# Altium schematic sheet Screen Driver.SchDoc: Graphics Driver PCB (part 3 of 3)
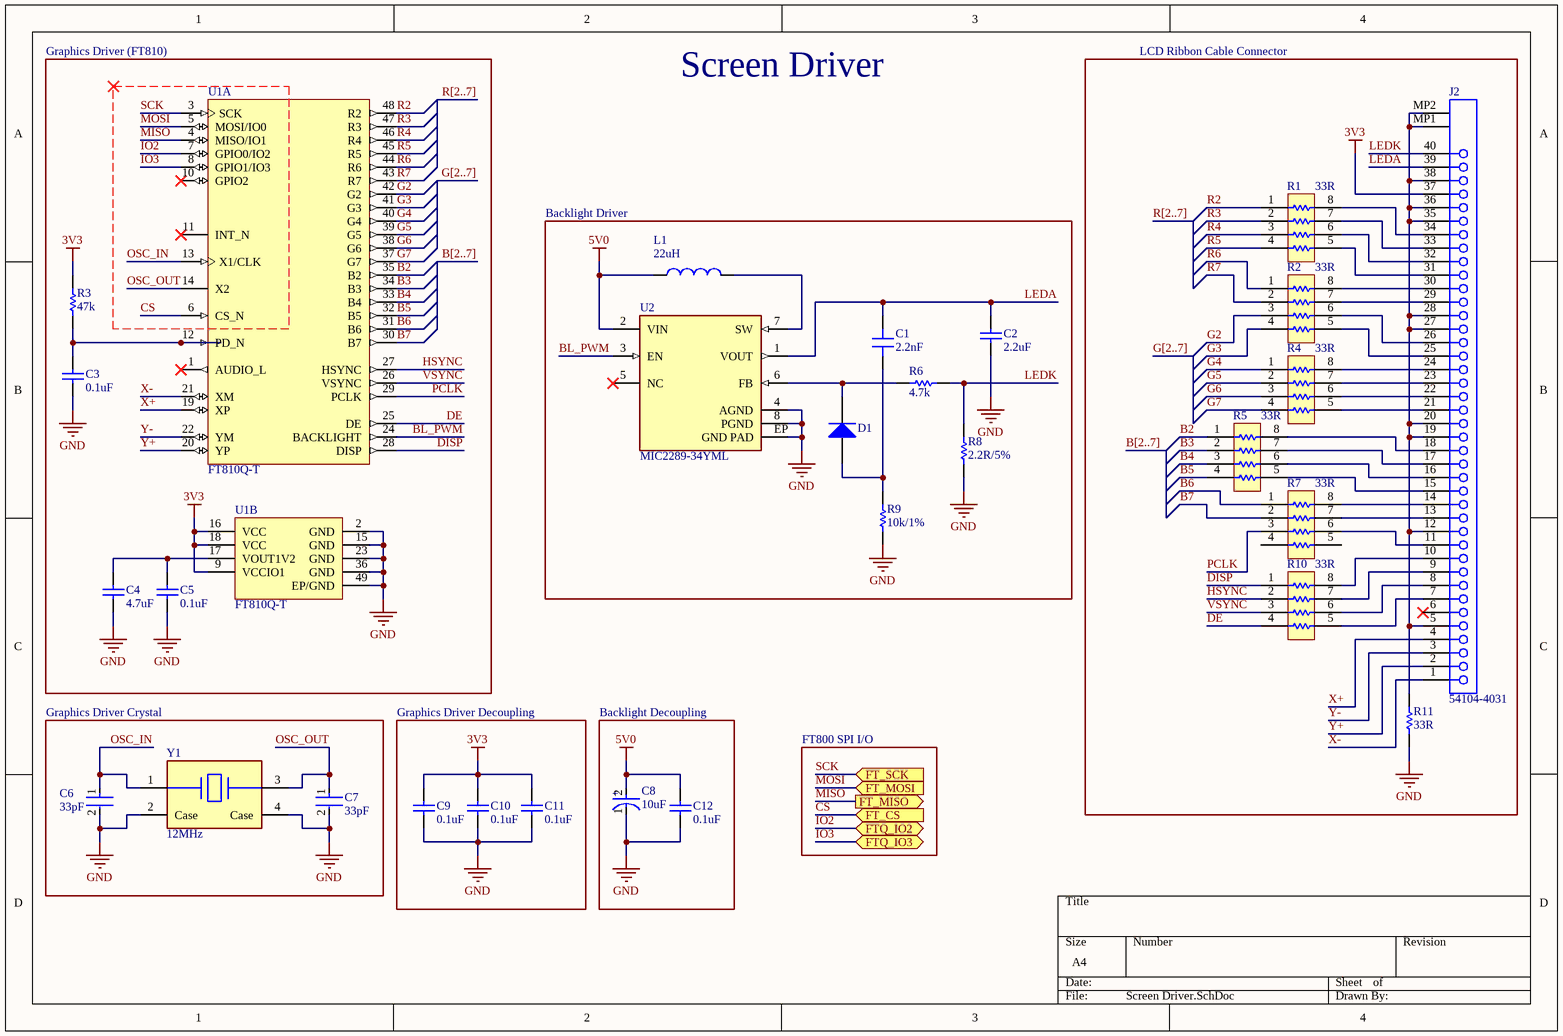
[diagram p2: Screen Driver.SchDoc]

## Library data of the parts (continued)
R8 = Resistor: Resistor;  Thick Film;  Res 2.2 Ohms;  Pwr-Rtg 0.125 W;  Tol 5%;  SMT;  0805;  Tape & Reel; Manufacturer: Panasonic; Manufacturer Part Number: ERJ-6GEYJ2R2V; Resistance: 2.2R; Power Rating: 125mW; Temperature Coefficient: 600ppm/°C; Voltage Rating (DC): 150V; Value: 2.2R/5%; Supplier 1: LCSC; Supplier Part Number 1: C413132; RoHS: Yes; Category: Chip SMD Resistors; Stock 1: 19900; Pricing 1: 50=0.00990, 500=0.00720, 1500=0.00670, 5000=0.00630, 25000=0.00600, 50000=0.00590, 50=0.00940, 500=0.00690, 1500=0.00640, 5000=0.00600, 25000=0.00580, 50000=0.00570, 50=0.04810, 500=0.03510, 1500=0.03280, 5000=0.03040, 25000=0.02930, 50000=0.02880, 50=0.04470, 500=0.03270, 1500=0.03050, 5000=0.02830, 25000=0.02730, 50000=0.02680, 50=0.00600, 500=0.00440, 1500=0.00410, 5000=0.00380, 25000=0.00370, 50000=0.00360, 50=0.00550, 500=0.00400, 1500=0.00370, 5000=0.00350, 25000=0.00330, 50000=0.00330, 50=0.05470, 500=0.04000, 1500=0.03730, 5000=0.03460, 25000=0.03340, 50000=0.03280, 50=0.74590, 500=0.54510, 1500=0.50830, 5000=0.47140, 25000=0.45500, 50000=0.44690, 50=0.02930, 500=0.02140, 1500=0.02000, 5000=0.01850, 25000=0.01790, 50000=0.01760, 50=0.55670, 500=0.40690, 1500=0.37930, 5000=0.35180, 25000=0.33960, 50000=0.33350, 50=0.06320, 500=0.04620, 1500=0.04310, 5000=0.04000, 25000=0.03860, 50000=0.03790, 50=0.00970, 500=0.00710, 1500=0.00660, 5000=0.00610, 25000=0.00590, 50000=0.00580, 50=0.00706, 500=0.00516, 1500=0.00481, 5000=0.00446, 25000=0.00431, 50000=0.00423 (AUD); Mount: Surface Mount; Case/Package: 0805; Case Code (Imperial): 0805; Case Code (Metric): 2012; Contact Plating: Tin; Min Operating Temperature: -55°C; Max Operating Temperature: 155°C; Tolerance: 5%; Packaging: Tape and Reel; Resistor Type: Thick Film; Termination: SMD/SMT; Package Quantity: 1; Voltage Rating: 150V; Number of Terminations: 2; Max Power Dissipation: 125mW; Features: Automotive AEC-Q200; Length: 2mm; Height: 0.6mm; Width: 1.25mm; Depth: 1.25mm; Radiation Hardening: No; Lead Free: Lead Free; Military Standard: Not; REACH SVHC: No SVHC; ComponentLink1URL: https://datasheet.ciiva.com/11821/0900766b80f806dd-11821604.pdf?src-supplier=RSComponents; ComponentLink1Description: https://datasheet.ciiva.com/11821/0900766b80f806dd-11821604.pdf?src-supplier=RSComponents; ComponentLink2URL: https://datasheet.ciiva.com/28680/1678796-28680822.pdf?src-supplier=Element14; ComponentLink2Description: https://datasheet.ciiva.com/28680/1678796-28680822.pdf?src-supplier=Element14; ComponentLink3URL: https://datasheet.ciiva.com/46373/1500035-46373994.pdf?src-supplier=Element14; ComponentLink3Description: https://datasheet.ciiva.com/46373/1500035-46373994.pdf?src-supplier=Element14; ComponentLink4URL: https://datasheet.ciiva.com/16771/70255313-16771325.pdf?src-supplier=Allied+Electronics; ComponentLink4Description: https://datasheet.ciiva.com/16771/70255313-16771325.pdf?src-supplier=Allied+Electronics; ComponentLink5URL: https://datasheet.ciiva.com/30154/4aoa0000ce1-30154238.pdf?src-supplier=Onlinecomponents.com; ComponentLink5Description: https://datasheet.ciiva.com/30154/4aoa0000ce1-30154238.pdf?src-supplier=Onlinecomponents.com; ComponentLink6URL: https://datasheet.ciiva.com/46386/1500035-46386709.pdf?src-supplier=Element14; ComponentLink6Description: https://datasheet.ciiva.com/46386/1500035-46386709.pdf?src-supplier=Element14; ComponentLink7URL: https://datasheet.ciiva.com/5868/1500035-5868203.pdf?src-supplier=Farnell; ComponentLink7Description: https://datasheet.ciiva.com/5868/1500035-5868203.pdf?src-supplier=Farnell; Supplier 2: Digi-Key; Supplier Part Number 2: P2.2ACT-ND; Stock 2: 66099; Pricing 2: 1=0.10000, 10=0.04900, 100=0.02010, 1000=0.00901, 2500=0.00782 (USD)
R9 = Resistor: PANASONIC - ERJ6ENF1002V - Ytmonterat chipmotstånd, Tjockfilm, 0805 [2012 Metrisk], 10 kohm, ERJ6E Serien, 150 V, Tjockfilm; Manufacturer Part Number: ERJ-6ENF1002V; Resistance: 10kR; Tolerance: 1%; Temperature Coefficient: 100ppm/°C; Power Rating: 125mW; Voltage Rating: 150V; Value: 10k/1%; Supplier 1: LCSC; Supplier Part Number 1: C169253; Manufacturer: Panasonic; RoHS: Yes; Category: Chip SMD Resistors; Stock 1: 51350; Pricing 1: 50=0.01510, 500=0.01110, 1500=0.01040, 5000=0.00970, 25000=0.00930, 50000=0.00920, 50=0.01440, 500=0.01060, 1500=0.00990, 5000=0.00920, 25000=0.00890, 50000=0.00880, 50=0.07360, 500=0.05410, 1500=0.05050, 5000=0.04700, 25000=0.04540, 50000=0.04460, 50=0.06850, 500=0.05030, 1500=0.04700, 5000=0.04370, 25000=0.04220, 50000=0.04150, 50=0.00920, 500=0.00680, 1500=0.00630, 5000=0.00590, 25000=0.00570, 50000=0.00560, 50=0.00840, 500=0.00620, 1500=0.00580, 5000=0.00540, 25000=0.00520, 50000=0.00510, 50=0.08370, 500=0.06150, 1500=0.05750, 5000=0.05340, 25000=0.05160, 50000=0.05070, 50=1.14090, 500=0.83920, 1500=0.78370, 5000=0.72830, 25000=0.70360, 50000=0.69140, 50=0.04490, 500=0.03300, 1500=0.03080, 5000=0.02860, 25000=0.02770, 50000=0.02720, 50=0.85150, 500=0.62630, 1500=0.58490, 5000=0.54360, 25000=0.52510, 50000=0.51600, 50=0.09670, 500=0.07120, 1500=0.06650, 5000=0.06180, 25000=0.05970, 50000=0.05860, 50=0.01480, 500=0.01090, 1500=0.01010, 5000=0.00940, 25000=0.00910, 50000=0.00890, 50=0.01080, 500=0.00794, 1500=0.00742, 5000=0.00689, 25000=0.00666, 50000=0.00654 (AUD); Mount: Surface Mount; Case/Package: 0805; Number of Pins: 2; Case Code (Metric): 2012; Case Code (Imperial): 0805; Contact Plating: Tin; Min Operating Temperature: -55°C; Max Operating Temperature: 155°C; Packaging: Tape and Reel; Resistor Type: Thick Film; Termination: SMD/SMT; Package Quantity: 5000; Voltage Rating (DC): 150V; Number of Terminations: 2; Max Power Dissipation: 125mW; Features: Automotive AEC-Q200; Working Voltage: 150V; Length: 2mm; Height: 0.6mm; Width: 0.049inch; Depth: 1.25mm; Radiation Hardening: No; Lead Free: Lead Free; Military Standard: Not; REACH SVHC: No SVHC; ComponentLink1URL: https://datasheet.ciiva.com/11808/0900766b80f80784-11808080.pdf?src-supplier=RSComponents; ComponentLink1Description: https://datasheet.ciiva.com/11808/0900766b80f80784-11808080.pdf?src-supplier=RSComponents; ComponentLink2URL: https://datasheet.ciiva.com/16759/70260748-16759350.pdf?src-supplier=Allied+Electronics; ComponentLink2Description: https://datasheet.ciiva.com/16759/70260748-16759350.pdf?src-supplier=Allied+Electronics; ComponentLink3URL: https://datasheet.ciiva.com/16725/70260748-16725031.pdf?src-supplier=Allied+Electronics; ComponentLink3Description: https://datasheet.ciiva.com/16725/70260748-16725031.pdf?src-supplier=Allied+Electronics; ComponentLink4URL: https://datasheet.ciiva.com/30140/aoa0000ce2-30140236.pdf?src-supplier=Onlinecomponents.com; ComponentLink4Description: https://datasheet.ciiva.com/30140/aoa0000ce2-30140236.pdf?src-supplier=Onlinecomponents.com; ComponentLink5URL: https://datasheet.ciiva.com/24070/aoa0000ce2-24070702.pdf?src-supplier=Mouser; ComponentLink5Description: https://datasheet.ciiva.com/24070/aoa0000ce2-24070702.pdf?src-supplier=Mouser; ComponentLink6URL: https://datasheet.ciiva.com/16514/aoa0000ce2-16514021.pdf?src-supplier=Avnet+Asia; ComponentLink6Description: https://datasheet.ciiva.com/16514/aoa0000ce2-16514021.pdf?src-supplier=Avnet+Asia; ComponentLink7URL: https://datasheet.ciiva.com/27055/1988971-27055733.pdf?src-supplier=Jameco; ComponentLink7Description: https://datasheet.ciiva.com/27055/1988971-27055733.pdf?src-supplier=Jameco; ComponentLink8URL: https://datasheet.ciiva.com/7830/426256-7830745.pdf?src-supplier=Element14; ComponentLink8Description: https://datasheet.ciiva.com/7830/426256-7830745.pdf?src-supplier=Element14; ComponentLink9URL: https://datasheet.ciiva.com/46372/1678782-46372714.pdf?src-supplier=Element14; ComponentLink9Description: https://datasheet.ciiva.com/46372/1678782-46372714.pdf?src-supplier=Element14; ComponentLink10URL: https://datasheet.ciiva.com/46372/1678782-46372715.pdf?src-supplier=Element14; ComponentLink10Description: https://datasheet.ciiva.com/46372/1678782-46372715.pdf?src-supplier=Element14; ComponentLink11URL: https://datasheet.ciiva.com/17212/aoa0000ce2-17212108.pdf?src-supplier=Avnet+Europe; ComponentLink11Description: https://datasheet.ciiva.com/17212/aoa0000ce2-17212108.pdf?src-supplier=Avnet+Europe; Supplier 2: Digi-Key; Supplier Part Number 2: P10.0KCCT-ND; Stock 2: 673575; Pricing 2: 1=0.10000, 10=0.06500, 100=0.02500, 1000=0.01100, 2500=0.00950 (USD)
R11 = Resistor: Res Thick Film 0805 33 Ohm 1% 0.125W(1/8W) ±100ppm/C Molded SMD Automotive Punched T/R; Manufacturer: Panasonic; Manufacturer Part Number: ERJ-6ENF33R0V; Temperature Coefficient: 100ppm/°C; Power Rating: 125mW; Voltage Rating (DC): 150V; Value: 33R; Supplier 1: LCSC; Supplier Part Number 1: C413254; RoHS: Yes; Category: Chip SMD Resistors; Stock 1: 20950; Pricing 1: 50=0.01480, 500=0.01080, 1500=0.01010, 5000=0.00940, 25000=0.00900, 50000=0.00890, 50=0.01420, 500=0.01040, 1500=0.00970, 5000=0.00900, 25000=0.00860, 50000=0.00850, 50=0.07210, 500=0.05270, 1500=0.04910, 5000=0.04560, 25000=0.04400, 50000=0.04320, 50=0.06710, 500=0.04900, 1500=0.04570, 5000=0.04240, 25000=0.04090, 50000=0.04020, 50=0.00900, 500=0.00660, 1500=0.00610, 5000=0.00570, 25000=0.00550, 50000=0.00540, 50=0.00820, 500=0.00600, 1500=0.00560, 5000=0.00520, 25000=0.00500, 50000=0.00490, 50=0.08200, 500=0.05990, 1500=0.05590, 5000=0.05180, 25000=0.05000, 50000=0.04910, 50=1.11830, 500=0.81730, 1500=0.76200, 5000=0.70680, 25000=0.68220, 50000=0.67010, 50=0.04400, 500=0.03210, 1500=0.03000, 5000=0.02780, 25000=0.02680, 50000=0.02640, 50=0.83460, 500=0.61000, 1500=0.56870, 5000=0.52750, 25000=0.50920, 50000=0.50010, 50=0.09480, 500=0.06930, 1500=0.06460, 5000=0.05990, 25000=0.05790, 50000=0.05680, 50=0.01450, 500=0.01060, 1500=0.00990, 5000=0.00910, 25000=0.00880, 50000=0.00870, 50=0.01058, 500=0.00773, 1500=0.00721, 5000=0.00669, 25000=0.00646, 50000=0.00634 (AUD); Mount: Surface Mount; Case/Package: 0805; Number of Pins: 2; Case Code (Imperial): 0805; Case Code (Metric): 2012; Contact Plating: Tin; Min Operating Temperature: -55°C; Max Operating Temperature: 155°C; Resistance: 33R; Tolerance: 1%; Packaging: Tape and Reel; Resistor Type: Thick Film; Package Quantity: 5000; Voltage Rating: 150V; Number of Terminations: 2; Termination: SMD/SMT; Max Power Dissipation: 125mW; Length: 2mm; Height: 0.6mm; Width: 1.2mm; Depth: 1.25mm; Radiation Hardening: No; REACH SVHC: No SVHC; Military Standard: Not; ComponentLink1URL: https://datasheet.ciiva.com/11821/0900766b80f80784-11821631.pdf?src-supplier=RSComponents; ComponentLink1Description: https://datasheet.ciiva.com/11821/0900766b80f80784-11821631.pdf?src-supplier=RSComponents; ComponentLink2URL: https://datasheet.ciiva.com/16786/70260748-16786245.pdf?src-supplier=Allied+Electronics; ComponentLink2Description: https://datasheet.ciiva.com/16786/70260748-16786245.pdf?src-supplier=Allied+Electronics; ComponentLink3URL: https://datasheet.ciiva.com/46420/1678782-46420182.pdf?src-supplier=Element14; ComponentLink3Description: https://datasheet.ciiva.com/46420/1678782-46420182.pdf?src-supplier=Element14; ComponentLink4URL: https://datasheet.ciiva.com/7836/426256-7836825.pdf?src-supplier=Element14; ComponentLink4Description: https://datasheet.ciiva.com/7836/426256-7836825.pdf?src-supplier=Element14; ComponentLink5URL: https://datasheet.ciiva.com/17210/aoa0000ce2-17210222.pdf?src-supplier=Avnet+Europe; ComponentLink5Description: https://datasheet.ciiva.com/17210/aoa0000ce2-17210222.pdf?src-supplier=Avnet+Europe; ComponentLink6URL: https://datasheet.ciiva.com/5917/426256-5917871.pdf?src-supplier=Farnell; ComponentLink6Description: https://datasheet.ciiva.com/5917/426256-5917871.pdf?src-supplier=Farnell; ComponentLink7URL: https://datasheet.ciiva.com/22673/1678782-22673295.pdf?src-supplier=Element14; ComponentLink7Description: https://datasheet.ciiva.com/22673/1678782-22673295.pdf?src-supplier=Element14; ComponentLink8URL: https://datasheet.ciiva.com/7836/426256-7836540.pdf?src-supplier=Element14; ComponentLink8Description: https://datasheet.ciiva.com/7836/426256-7836540.pdf?src-supplier=Element14; ComponentLink9URL: https://datasheet.ciiva.com/16516/aoa0000ce2-16516861.pdf?src-supplier=Avnet+Asia; ComponentLink9Description: https://datasheet.ciiva.com/16516/aoa0000ce2-16516861.pdf?src-supplier=Avnet+Asia; ComponentLink10URL: https://datasheet.ciiva.com/30127/aoa0000ce2-30127853.pdf?src-supplier=Onlinecomponents.com; ComponentLink10Description: https://datasheet.ciiva.com/30127/aoa0000ce2-30127853.pdf?src-supplier=Onlinecomponents.com; Supplier 2: Digi-Key; Supplier Part Number 2: P33.0CCT-ND; Stock 2: 8470; Pricing 2: 1=0.10000, 10=0.06500, 100=0.02500, 1000=0.01100, 2500=0.00950 (USD)
U1 = CMP-0582-00003-1: FT810 Single Chip Embedded Graphic Controller (Embedded Video Engine), 18-bit RGB, resistive touch, -40 to +85 degC, 48-pin VQFN, Pb-Free, Tray; Manufacturer: FTDI; DatasheetVersion: ver 1.2, Sep-2015; PackageReference: VQFN-48_5.2x5.2EP; ComponentLink2Description: Datasheet; ComponentLink1URL: http://www.ftdichip.com/; ComponentLink2URL: http://www.ftdichip.com/Support/Documents/DataSheets/ICs/DS_FT81x.pdf; PackageDescription: 48-Pin Very Thin Quad Flat No-Lead, 7 x 7 mm Body, 0.5 mm Pitch, 5.2 x 5.2 mm Exposed Pad; ComponentLink1Description: Manufacturer URL; Supplier 1: Digi-Key; Supplier Part Number 1: 768-1257-ND
U2 = MIC2289: IC LED Driver IC 1 Output DC DC Regulator Step-Up (Boost) Analog, PWM Dimming 750mA (Switch) 8-MLF® (2x2); Manufacturer: Microchip; Mfg Package Ident: ML; Voltage - Output: 34V; Voltage - Supply: 2.5V ~ 10V; helpURL: https://upverter.com/upn/revision/081cbec266e60c90/; ComponentLink2Description: Datasheet; Temperature: -40°C to +125°C; Package: ML; Supplier 2: LCSC; Supplier 1: Digi-Key; ComponentLink1URL: https://upverter.com/upn/revision/081cbec266e60c90/; Supplier Part Number 2: C147904; Supplier Part Number 1: 576-1732-1-ND; ComponentLink1Description: Upverter; ComponentLink2URL: http://ww1.microchip.com/downloads/en/DeviceDoc/mic2289.pdf; RoHS: TRUE; Mouser Part Number: 998-MIC2289-34YMLTR; Ipc Land Pattern Name: DFN200X200X85-8; Temperature Range High: +125°C; Digikey Description: IC LED Driver IC 1 Output DC DC Regulator Step-Up (Boost) Analog, PWM Dimming 750mA (Switch) 8-MLF® (2x2); Digikey Part Number: 576-1732-1-ND; Current - Output / Channel: 750mA; Lead Free: yes; Temperature Range Low: -40°C
Y1 = CMP-12687-000001-1: CRYSTAL 12MHZ 18PF SMD; Manufacturer: Diodes; Manufacturer Part Number: FL1200112; ESR (Equivalent Series Resistance): 80R; Frequency Tolerance: 30ppm; Mount: Surface Mount; Frequency: 12MHz; Case/Package: SMD/SMT; Load Capacitance: 18pF; Packaging: Tape and Reel; Max Operating Temperature: 85°C; Min Operating Temperature: -40°C; Frequency Stability: 30ppm; Height: 0.03inch; Width: 0.098inch; Length: 0.126inch; Supplier 1: Digi-Key; Supplier Part Number 1: FL1200112CT-ND; RoHS: Yes; Category: Crystals; Stock 1: 4963; Pricing 1: 1=0.70000, 10=0.58300, 50=0.52440, 100=0.46620, 500=0.44290, 1000=0.37296 (USD); ComponentLink1URL: https://www.diodes.com/assets/Datasheets/FL.pdf?src-supplier=Digi-Key; ComponentLink1Description: https://www.diodes.com/assets/Datasheets/FL.pdf?src-supplier=Digi-Key; Supplier 2: LCSC; Supplier Part Number 2: C654951